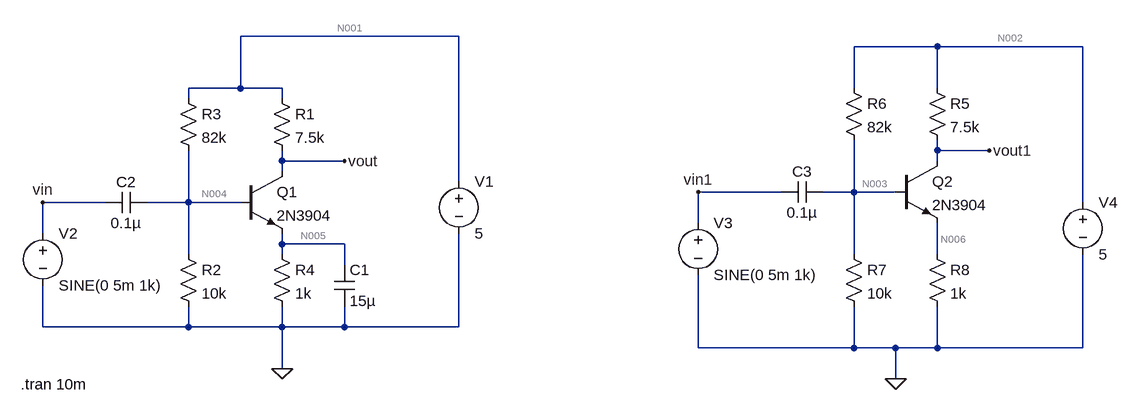
[diagram p0: schematic amp_1stage.asc]
amp_1stage.asc, the LTspice schematic file:
Version 4
SHEET 1 1512 680
WIRE 496 -96 160 -96
WIRE 1232 -80 1104 -80
WIRE 1456 -80 1232 -80
WIRE 160 -16 160 -96
WIRE 160 -16 80 -16
WIRE 224 -16 160 -16
WIRE 1104 -16 1104 -80
WIRE 1232 -16 1232 -80
WIRE 80 0 80 -16
WIRE 224 0 224 -16
WIRE 1232 80 1232 64
WIRE 1312 80 1232 80
WIRE 224 96 224 80
WIRE 320 96 224 96
WIRE 1232 96 1232 80
WIRE 224 112 224 96
WIRE 496 128 496 -96
WIRE 992 144 864 144
WIRE 1104 144 1104 64
WIRE 1104 144 1056 144
WIRE 1168 144 1104 144
WIRE -48 160 -144 160
WIRE 80 160 80 80
WIRE 80 160 16 160
WIRE 160 160 80 160
WIRE 1456 160 1456 -80
WIRE 864 192 864 144
WIRE -144 208 -144 160
WIRE 224 224 224 208
WIRE 320 224 224 224
WIRE 80 240 80 160
WIRE 224 240 224 224
WIRE 1104 240 1104 144
WIRE 1232 240 1232 192
WIRE 320 256 320 224
WIRE -144 352 -144 288
WIRE 80 352 80 320
WIRE 80 352 -144 352
WIRE 224 352 224 320
WIRE 224 352 80 352
WIRE 320 352 320 320
WIRE 320 352 224 352
WIRE 496 352 496 208
WIRE 496 352 320 352
WIRE 864 384 864 272
WIRE 1104 384 1104 320
WIRE 1104 384 864 384
WIRE 1168 384 1104 384
WIRE 1232 384 1232 320
WIRE 1232 384 1168 384
WIRE 1456 384 1456 240
WIRE 1456 384 1232 384
WIRE 224 416 224 352
WIRE 1168 432 1168 384
FLAG 224 416 0
FLAG -144 160 vin
FLAG 320 96 vout
FLAG 1168 432 0
FLAG 1312 80 vout1
FLAG 864 144 vin1
SYMBOL npn 160 112 R0
SYMATTR InstName Q1
SYMATTR Value 2N3904
SYMBOL res 208 -16 R0
SYMATTR InstName R1
SYMATTR Value 7.5k
SYMBOL res 64 224 R0
SYMATTR InstName R2
SYMATTR Value 10k
SYMBOL res 64 -16 R0
SYMATTR InstName R3
SYMATTR Value 82k
SYMBOL res 208 224 R0
SYMATTR InstName R4
SYMATTR Value 1k
SYMBOL cap 304 256 R0
SYMATTR InstName C1
SYMATTR Value 15µ
SYMBOL cap 16 144 R90
WINDOW 0 0 32 VBottom 2
WINDOW 3 32 32 VTop 2
SYMATTR InstName C2
SYMATTR Value 0.1µ
SYMBOL voltage 496 112 R0
WINDOW 123 0 0 Left 0
WINDOW 39 0 0 Left 0
SYMATTR InstName V1
SYMATTR Value 5
SYMBOL voltage -144 192 R0
WINDOW 123 0 0 Left 0
WINDOW 39 0 0 Left 0
SYMATTR InstName V2
SYMATTR Value SINE(0 5m 1k)
SYMBOL npn 1168 96 R0
SYMATTR InstName Q2
SYMATTR Value 2N3904
SYMBOL res 1216 -32 R0
SYMATTR InstName R5
SYMATTR Value 7.5k
SYMBOL res 1088 -32 R0
SYMATTR InstName R6
SYMATTR Value 82k
SYMBOL res 1088 224 R0
SYMATTR InstName R7
SYMATTR Value 10k
SYMBOL res 1216 224 R0
SYMATTR InstName R8
SYMATTR Value 1k
SYMBOL cap 1056 128 R90
WINDOW 0 0 32 VBottom 2
WINDOW 3 32 32 VTop 2
SYMATTR InstName C3
SYMATTR Value 0.1µ
SYMBOL voltage 864 176 R0
WINDOW 123 0 0 Left 0
WINDOW 39 0 0 Left 0
SYMATTR InstName V3
SYMATTR Value SINE(0 5m 1k)
SYMBOL voltage 1456 144 R0
WINDOW 123 0 0 Left 0
WINDOW 39 0 0 Left 0
SYMATTR InstName V4
SYMATTR Value 5
TEXT -178 440 Left 2 !.tran 10m

The netlist it stands for:
* amp_1stage.asc
Q1 vout N004 N005 0 2N3904
R1 N001 vout 7.5k
R2 N004 0 10k
R3 N001 N004 82k
R4 N005 0 1k
C1 N005 0 15µ
C2 N004 vin 0.1µ
V1 N001 0 5
V2 vin 0 SINE(0 5m 1k)
Q2 vout1 N003 N006 0 2N3904
R5 N002 vout1 7.5k
R6 N002 N003 82k
R7 N003 0 10k
R8 N006 0 1k
C3 N003 vin1 0.1µ
V3 vin1 0 SINE(0 5m 1k)
V4 N002 0 5
.model NPN NPN
.model PNP PNP
.lib standard.bjt
.tran 10m
.backanno
.end

* Results of the author's LTspice run, read from the files saved beside the schematic
* Operating Point, zero values left out:
*   V(vout) = 4.929 V
*   V(n004) = 543.2 mV
*   V(n005) = 9.559 mV
*   V(n001) = 5 V
*   V(vout1) = 4.929 V
*   V(n003) = 543.2 mV
*   V(n006) = 9.559 mV
*   V(n002) = 5 V
*   Ic(Q1) = 9.528 µA
*   Ib(Q1) = 30.42 nA
*   Ie(Q1) = -9.559 µA
*   Ic(Q2) = 9.528 µA
*   Ib(Q2) = 30.42 nA
*   Ie(Q2) = -9.559 µA
*   I(R1) = 9.528 µA
*   I(R2) = 54.32 µA
*   I(R3) = 54.35 µA
*   I(R4) = 9.559 µA
*   I(R5) = 9.528 µA
*   I(R6) = 54.35 µA
*   I(R7) = 54.32 µA
*   I(R8) = 9.559 µA
*   I(V1) = -63.88 µA
*   I(V4) = -63.88 µA
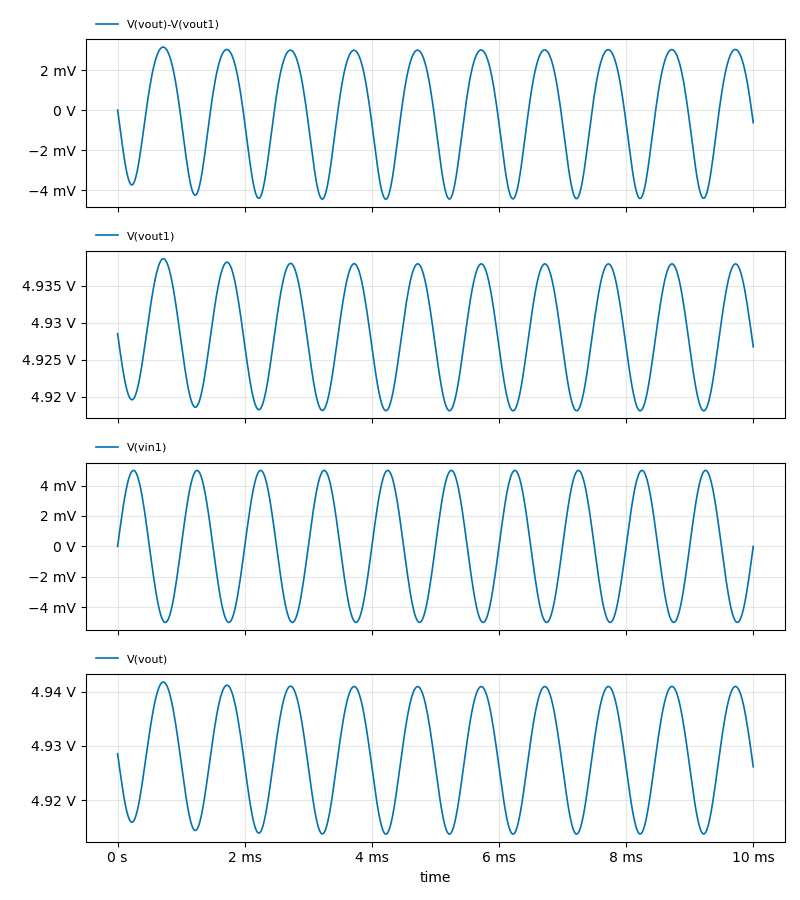
[diagram p1: Transient Analysis of amp_1stage.asc, plotted from the saved traces]
* Transient Analysis, 1 run:
*   V(vout)-V(vout1): min -4.442 mV, max 3.149 mV, average -268 µV, rms 2.621 mV, last -626.1 µV
*   V(vout1): min 4.918 V, max 4.939 V, average 4.928 V, rms 4.928 V, last 4.927 V
*   V(vin1): min -5 mV, max 5 mV, average -637 nV, rms 3.538 mV, last 0 V
*   V(vout): min 4.914 V, max 4.942 V, average 4.928 V, rms 4.928 V, last 4.926 V